# EasyEDA schematic Space_Pony_Prototype_1.json
TITLE: Sheet_1; REV: 1.0; Date: 2023-06-10; Sheet: 1/1; Company: Your Company
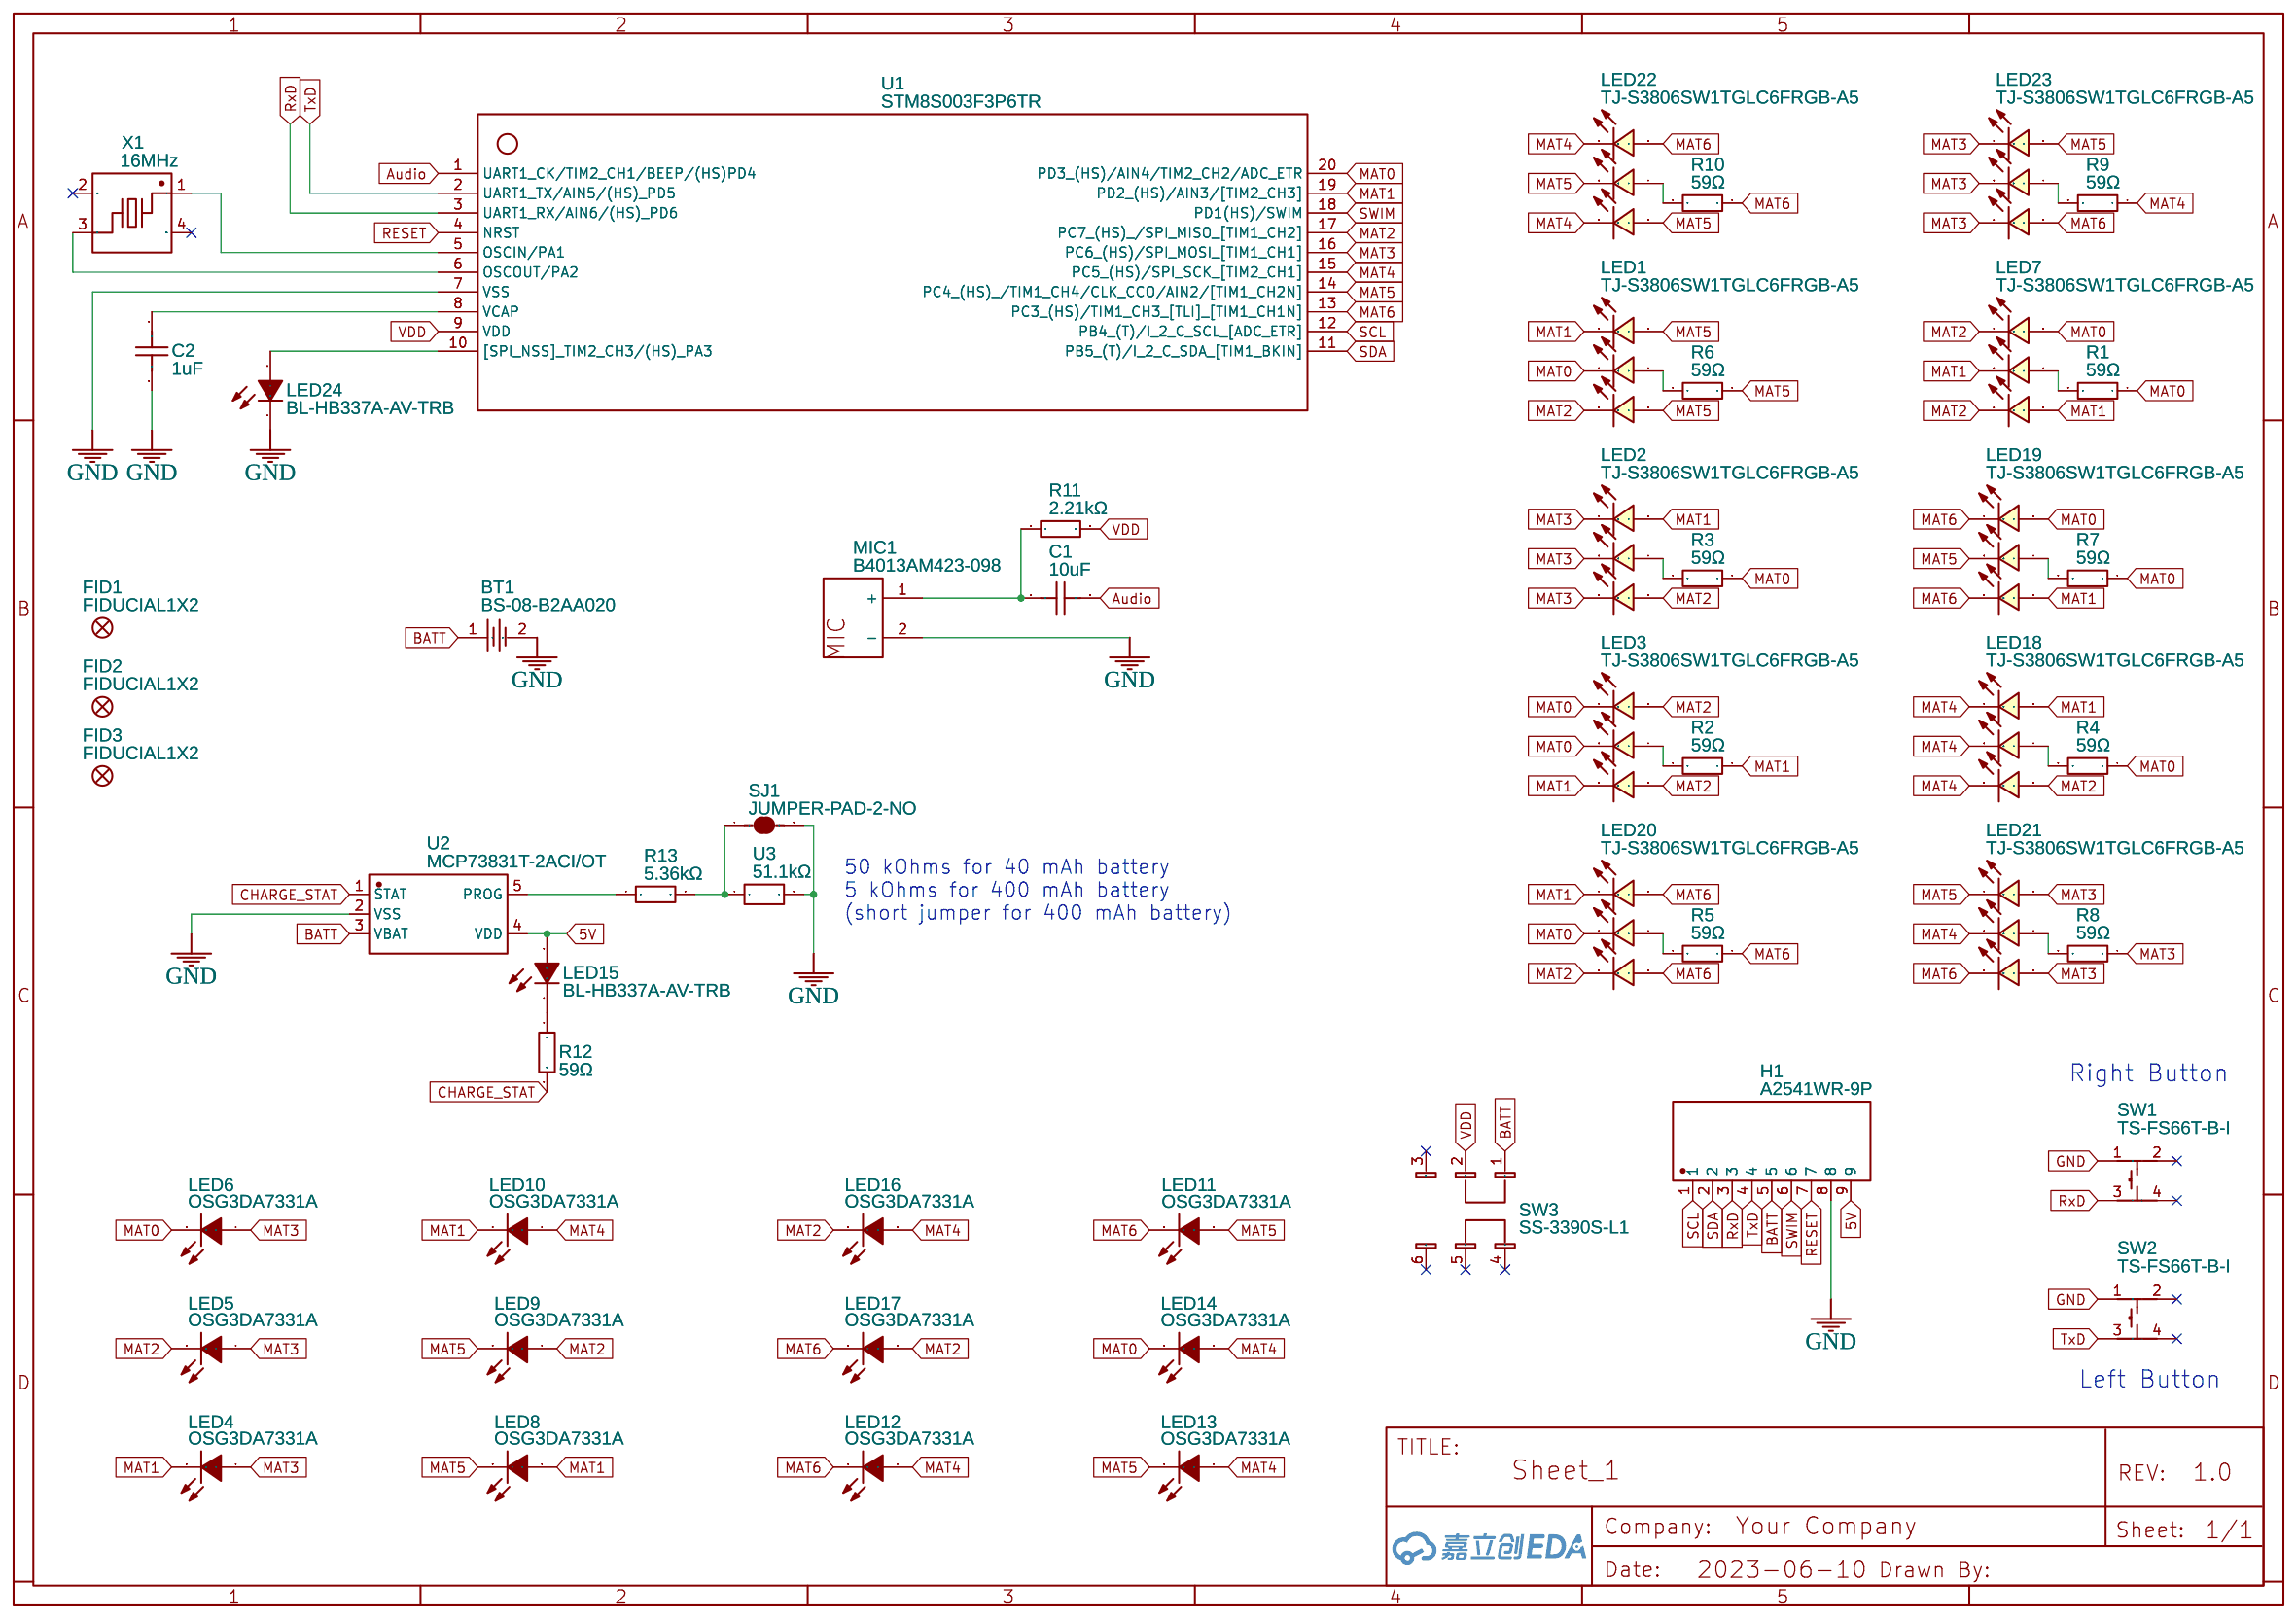
[diagram p0: schematic sheet]

## Parts
BT1  BS-08-B2AA020  [BAT-SMD_BS-08-B2AA016]
C1  10uF  [C0402]
C2  1uF  [C0402]
FID1  FIDUCIAL1X2  [FIDUCIAL1X2]
FID2  FIDUCIAL1X2  [FIDUCIAL1X2]
FID3  FIDUCIAL1X2  [FIDUCIAL1X2]
H1  A2541WR-9P  [HDR-TH_9P-P2.54-H-W8.6_A2541WR-9P]
LED1  TJ-S3806SW1TGLC6FRGB-A5  [LED-SMD_6P-L4.5-W1.0_TJ-S3806SW1TGLC6F]
LED2  TJ-S3806SW1TGLC6FRGB-A5  [LED-SMD_6P-L4.5-W1.0_TJ-S3806SW1TGLC6F]
LED3  TJ-S3806SW1TGLC6FRGB-A5  [LED-SMD_6P-L4.5-W1.0_TJ-S3806SW1TGLC6F]
LED4  OSG3DA7331A  [LED-TH_L3.3-W2.4-P2.54-FD]
LED5  OSG3DA7331A  [LED-TH_L3.3-W2.4-P2.54-FD]
LED6  OSG3DA7331A  [LED-TH_L3.3-W2.4-P2.54-FD]
LED7  TJ-S3806SW1TGLC6FRGB-A5  [LED-SMD_6P-L4.5-W1.0_TJ-S3806SW1TGLC6F]
LED8  OSG3DA7331A  [LED-TH_L3.3-W2.4-P2.54-FD]
LED9  OSG3DA7331A  [LED-TH_L3.3-W2.4-P2.54-FD]
LED10  OSG3DA7331A  [LED-TH_L3.3-W2.4-P2.54-FD]
LED11  OSG3DA7331A  [LED-TH_L3.3-W2.4-P2.54-FD]
LED12  OSG3DA7331A  [LED-TH_L3.3-W2.4-P2.54-FD]
LED13  OSG3DA7331A  [LED-TH_L3.3-W2.4-P2.54-FD]
LED14  OSG3DA7331A  [LED-TH_L3.3-W2.4-P2.54-FD]
LED15  BL-HB337A-AV-TRB  [LED0402-R-RD]
LED16  OSG3DA7331A  [LED-TH_L3.3-W2.4-P2.54-FD]
LED17  OSG3DA7331A  [LED-TH_L3.3-W2.4-P2.54-FD]
LED18  TJ-S3806SW1TGLC6FRGB-A5  [LED-SMD_6P-L4.5-W1.0_TJ-S3806SW1TGLC6F]
LED19  TJ-S3806SW1TGLC6FRGB-A5  [LED-SMD_6P-L4.5-W1.0_TJ-S3806SW1TGLC6F]
LED20  TJ-S3806SW1TGLC6FRGB-A5  [LED-SMD_6P-L4.5-W1.0_TJ-S3806SW1TGLC6F]
LED21  TJ-S3806SW1TGLC6FRGB-A5  [LED-SMD_6P-L4.5-W1.0_TJ-S3806SW1TGLC6F]
LED22  TJ-S3806SW1TGLC6FRGB-A5  [LED-SMD_6P-L4.5-W1.0_TJ-S3806SW1TGLC6F]
LED23  TJ-S3806SW1TGLC6FRGB-A5  [LED-SMD_6P-L4.5-W1.0_TJ-S3806SW1TGLC6F]
LED24  BL-HB337A-AV-TRB  [LED0402-R-RD]
MIC1  B4013AM423-098  [MIC-SMD_BD4.0_B4013AM423-098_WIDER_TRACE_CLEARANCE]
R1  59Ω  [R0402]
R2  59Ω  [R0402]
R3  59Ω  [R0402]
R4  59Ω  [R0402]
R5  59Ω  [R0402]
R6  59Ω  [R0402]
R7  59Ω  [R0402]
R8  59Ω  [R0402]
R9  59Ω  [R0402]
R10  59Ω  [R0402]
R11  2.21kΩ  [R0402]
R12  59Ω  [R0402]
R13  5.36kΩ  [R0402]
SJ1  JUMPER-PAD-2-NO  [PAD-JUMPER-2-NO_NO_SILK]
SW1  TS-FS66T-B-I  [KEY-SMD_4P-L6.1-W6.1-P4.50-LS9.0]
SW2  TS-FS66T-B-I  [KEY-SMD_4P-L6.1-W6.1-P4.50-LS9.0]
SW3  SS-3390S-L1  [SW-SMD_6P-P2.50_L3.5-W7.2]
U1  STM8S003F3P6TR  [TSSOP-20_L6.5-W4.4-P0.65-LS6.4-BL]
U2  MCP73831T-2ACI/OT  [SOT-23-5_L3.0-W1.7-P0.95-LS2.8-BL]
U3  51.1kΩ  [R0402]
X1  16MHz  [CRYSTAL-SMD_4P-L3.2-W2.5-BL-1]

## Library data of the parts
BT1 = BS-08-B2AA020: Supplier: LCSC; Supplier Part: C964786; Manufacturer: MYOUNG(美阳); Contributor: LCSC; JLCPCB Part Class: Extended Part
C1 = GRM155R60J106ME05D: Supplier: LCSC; Supplier Part: C723895; Manufacturer: muRata(村田); Contributor: LCSC; JLCPCB Part Class: Extended Part
C2 = CL05B105KQ5NQNC: Supplier: LCSC; Supplier Part: C307427; Manufacturer: SAMSUNG(三星); Contributor: LCSC; JLCPCB Part Class: Extended Part
FID1-FID3 = FIDUCIAL1X2: Fiducial Alignment Points; Contributor: SparkFun
H1 = A2541WR-9P: Supplier: LCSC; Supplier Part: C225495; Manufacturer: Changjiang Connectors; Contributor: LCSC; JLCPCB Part Class: Extended Part; Package Display: No
LED1-LED3 LED7 LED18-LED23 = TJ-S3806SW1TGLC6FRGB-A5: Supplier: LCSC; Supplier Part: C601694; Manufacturer: TOGIALED(统佳); Contributor: LCSC; JLCPCB Part Class: Extended Part
LED4-LED6 LED8-LED14 LED16 LED17 = OSG3DA7331A: Supplier: LCSC; Supplier Part: C268274; Manufacturer: OptoSupply(光谷); Contributor: LCSC; JLCPCB Part Class: Extended Part
LED15 LED24 = BL-HB337A-AV-TRB: Supplier: LCSC; Manufacturer: BrtLed(佰鸿); Contributor: LCSC; Supplier Part: C165977; JLCPCB Part Class: Extended Part
MIC1 = B4013AM423-098: Supplier: LCSC; Supplier Part: C2835889; Manufacturer: Goertek(歌尔); Contributor: LCSC; JLCPCB Part Class: Extended Part; Package Display: No
R1-R10 R12 = RTT0259R0FTH: Supplier: LCSC; Manufacturer: RALEC(旺诠); Resistance (Ohms): 59; Contributor: LCSC; Supplier Part: C159005; JLCPCB Part Class: Extended Part
R11 = CR0402FF2211G: Supplier: LCSC; Manufacturer: LIZ(丽智电子); Resistance (Ohms): 2.21K; Supplier Part: C100313; JLCPCB Part Class: Extended Part
R13 = CR0402FF5361G: Supplier: LCSC; Manufacturer: LIZ(丽智电子); Resistance (Ohms): 5.36K; Supplier Part: C100471; JLCPCB Part Class: Extended Part
SJ1 = JUMPER-PAD-2-NO: Contributor: SparkFun
SW1 SW2 = TS-FS66T-B-I: Supplier: LCSC; Supplier Part: C500114; Manufacturer: XKB Connectivity(中国星坤); Contributor: LCSC; JLCPCB Part Class: Extended Part
SW3 = SS-3390S-L1: Supplier: LCSC; Supplier Part: C318998; Manufacturer: XKB Connectivity(中国星坤); Contributor: LCSC; JLCPCB Part Class: Extended Part
U1 = STM8S003F3P6TR: Supplier: LCSC; Manufacturer: ST(意法半导体); Supplier Part: C52717; JLCPCB Part Class: Basic Part
U2 = MCP73831T-2ACI/OT: Supplier: LCSC; Supplier Part: C424093; Manufacturer: MICROCHIP(美国微芯); Contributor: LCSC; JLCPCB Part Class: Extended Part
U3 = MCR01MZPF5112: Supplier: LCSC; Supplier Part: C509676; Manufacturer: ROHM(罗姆); Contributor: LCSC
X1 = XXHBBCNANF-16.000000MHZ: Supplier: LCSC; Supplier Part: C521590; Manufacturer: TAITIEN(泰艺电子); Contributor: LCSC; JLCPCB Part Class: Extended Part

## Nets
5V: H1.9 LED15.2(A) U2.4(VDD)
GND: BT1.2 C2.2 H1.8 LED24.1(K) MIC1.2(-) SJ1.2 SW1.1 SW2.1 U1.7(VSS) U2.2(VSS) U3.2
VDD: R11.2 SW3.2 U1.9(VDD)
Audio: C1.2 U1.1(UART1_CK/TIM2_CH1/BEEP/(HS)PD4)
BATT: BT1.1 H1.5 SW3.1 U2.3(VBAT)
CHARGE_STAT: R12.2 U2.1(STAT)
MAT0: LED1.3(C) LED3.1(C) LED3.3(C) LED6.2(K) LED7.2(A) LED14.2(K) LED19.2(A) LED20.3(C) R1.1 R3.1 R4.1 R7.1 U1.20(PD3 (HS)/AIN4/TIM2_CH2/ADC_ETR)
MAT1: LED1.1(C) LED2.2(A) LED3.5(C) LED4.2(K) LED7.3(C) LED7.6(A) LED8.1(A) LED10.2(K) LED18.2(A) LED19.6(A) LED20.1(C) R2.1 U1.19(PD2 (HS)/AIN3/[TIM2_CH3])
MAT2: LED1.5(C) LED2.6(A) LED3.2(A) LED3.6(A) LED5.2(K) LED7.1(C) LED7.5(C) LED9.1(A) LED16.2(K) LED17.1(A) LED18.6(A) LED20.5(C) U1.17(PC7 (HS) /SPI_MISO [TIM1_CH2])
MAT3: LED2.1(C) LED2.3(C) LED2.5(C) LED4.1(A) LED5.1(A) LED6.1(A) LED21.2(A) LED21.6(A) LED23.1(C) LED23.3(C) LED23.5(C) R8.1 U1.16(PC6 (HS)/SPI_MOSI [TIM1_CH1])
MAT4: LED10.1(A) LED12.1(A) LED13.1(A) LED14.1(A) LED16.1(A) LED18.1(C) LED18.3(C) LED18.5(C) LED21.3(C) LED22.1(C) LED22.5(C) R9.1 U1.15(PC5 (HS)/SPI_SCK [TIM2_CH1])
MAT5: LED1.2(A) LED1.6(A) LED8.2(K) LED9.2(K) LED11.1(A) LED13.2(K) LED19.3(C) LED21.1(C) LED22.3(C) LED22.6(A) LED23.2(A) R6.1 U1.14(PC4 (HS) /TIM1_CH4/CLK_CCO/AIN2/[TIM1_CH2N])
MAT6: LED11.2(K) LED12.2(K) LED17.2(K) LED19.1(C) LED19.5(C) LED20.2(A) LED20.6(A) LED21.5(C) LED22.2(A) LED23.6(A) R5.1 R10.1 U1.13(PC3 (HS)/TIM1_CH3 [TLI] [TIM1_CH1N])
RESET: H1.7 U1.4(NRST)
RxD: H1.3 SW1.3 U1.3(UART1_RX/AIN6/(HS) PD6)
SCL: H1.1 U1.12(PB4 (T)/I 2 C_SCL [ADC_ETR])
SDA: H1.2 U1.11(PB5 (T)/I 2 C_SDA [TIM1_BKIN])
SWIM: H1.6 U1.18(PD1(HS)/SWIM)
TxD: H1.4 SW2.3 U1.2(UART1_TX/AIN5/(HS) PD5)
Net-(C1-1): C1.1 MIC1.1(+) R11.1
Net-(C2-1): C2.1 U1.8(VCAP)
Net-(LED1-4): LED1.4(A) R6.2
Net-(LED2-4): LED2.4(A) R3.2
Net-(LED3-4): LED3.4(A) R2.2
Net-(LED7-4): LED7.4(A) R1.2
Net-(LED15-1): LED15.1(K) R12.1
Net-(LED18-4): LED18.4(A) R4.2
Net-(LED19-4): LED19.4(A) R7.2
Net-(LED20-4): LED20.4(A) R5.2
Net-(LED21-4): LED21.4(A) R8.2
Net-(LED22-4): LED22.4(A) R10.2
Net-(LED23-4): LED23.4(A) R9.2
Net-(LED24-2): LED24.2(A) U1.10([SPI_NSS] TIM2_CH3/(HS) PA3)
Net-(R13-1): R13.1 U2.5(PROG)
Net-(R13-2): R13.2 SJ1.1 U3.1
Net-(U1-5): U1.5(OSCIN/PA1) X1.1
Net-(U1-6): U1.6(OSCOUT/PA2) X1.3

Not connected (* = marked no-connect by the designer): SW1 2* 4*; SW2 2* 4*; SW3 3* 4* 5* 6*; X1 2(GND)* 4(GND)*

## Notes on the sheet
- 50 kOhms for 40 mAh battery
  5 kOhms for 400 mAh battery
  (short jumper for 400 mAh battery)
- Right Button
- Left Button
